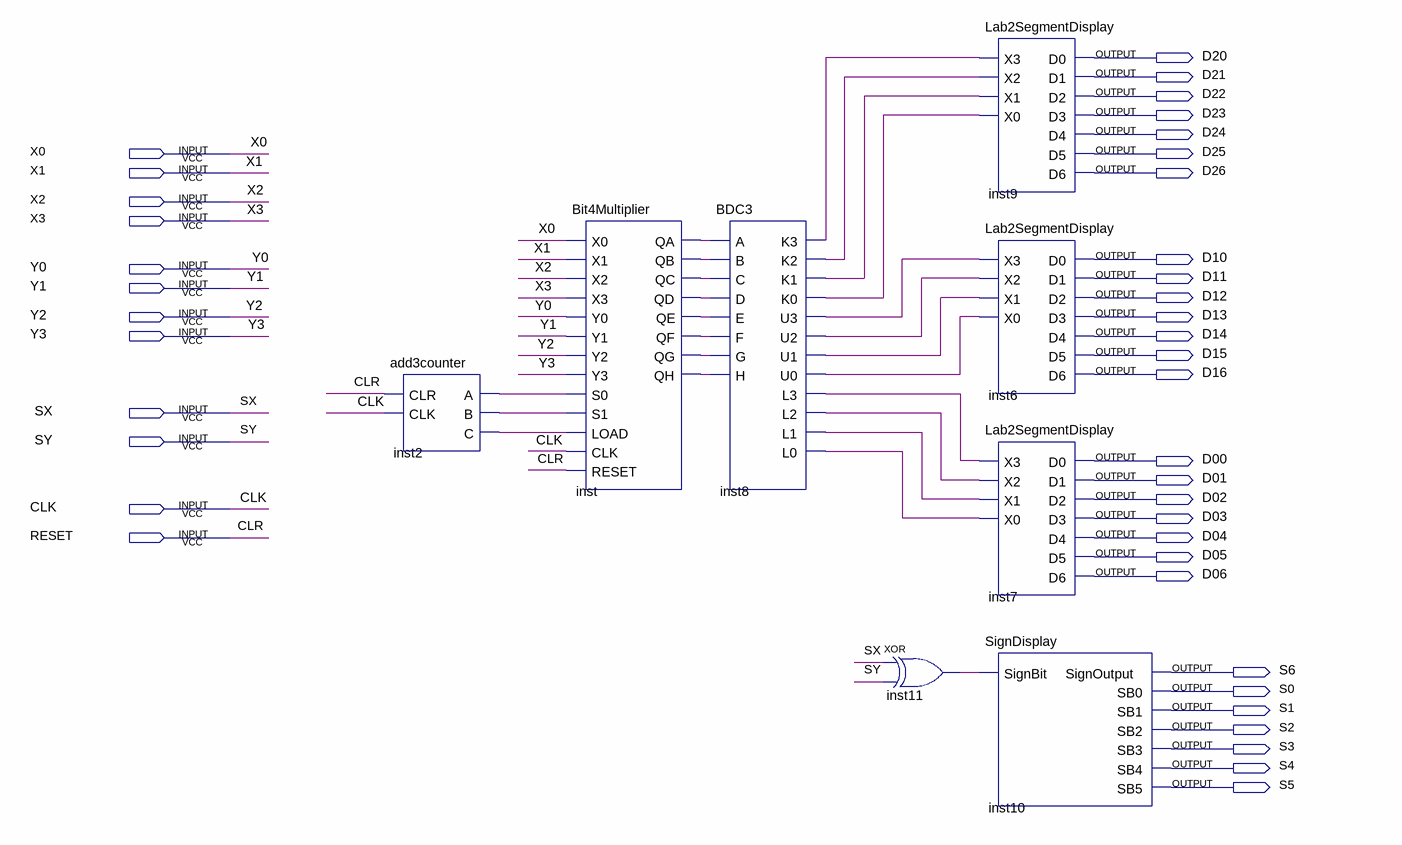
[diagram p0: schematic sheet]
// Quartus schematic Bit4MultDisplay.bdf as structural Verilog: 8 symbols, 40 pins
module Bit4MultDisplay (
  input  X0,
  input  X1,
  input  X2,
  input  X3,
  input  Y0,
  input  Y1,
  input  Y2,
  input  Y3,
  input  SX,
  input  SY,
  input  CLK,
  input  RESET,
  output D20,
  output D21,
  output D22,
  output D23,
  output D24,
  output D25,
  output D26,
  output D10,
  output D11,
  output D12,
  output D13,
  output D14,
  output D15,
  output D16,
  output D00,
  output D01,
  output D02,
  output D03,
  output D04,
  output D05,
  output D06,
  output S6,
  output S0,
  output S1,
  output S2,
  output S3,
  output S4,
  output S5
);

  wire inst2_a, inst2_b, inst2_c, inst8_k0, inst8_k1, inst8_k2, inst8_k3, inst8_l0, inst8_l1, inst8_l2,
       inst8_l3, inst8_u0, inst8_u1, inst8_u2, inst8_u3, inst11_out, inst_qa, inst_qb, inst_qc, inst_qd,
       inst_qe, inst_qf, inst_qg, inst_qh;

  add3counter inst2 (.CLR(RESET), .CLK(CLK), .A(inst2_a), .B(inst2_b), .C(inst2_c));
  Bit4Multiplier inst (
    .X0(X0), .X1(X1), .X2(X2), .X3(X3), .Y0(Y0), .Y1(Y1), .Y2(Y2), .Y3(Y3), .S0(inst2_a), .S1(inst2_b),
    .LOAD(inst2_c), .CLK(CLK), .RESET(RESET), .QA(inst_qa), .QB(inst_qb), .QC(inst_qc), .QD(inst_qd),
    .QE(inst_qe), .QF(inst_qf), .QG(inst_qg), .QH(inst_qh));
  BDC3 inst8 (
    .A(inst_qa), .B(inst_qb), .C(inst_qc), .D(inst_qd), .E(inst_qe), .F(inst_qf), .G(inst_qg), .H(inst_qh),
    .K3(inst8_k3), .K2(inst8_k2), .K1(inst8_k1), .K0(inst8_k0), .U3(inst8_u3), .U2(inst8_u2), .U1(inst8_u1),
    .U0(inst8_u0), .L3(inst8_l3), .L2(inst8_l2), .L1(inst8_l1), .L0(inst8_l0));
  xor inst11 (inst11_out, SX, SY);
  Lab2SegmentDisplay inst9 (
    .X3(inst8_k3), .X2(inst8_k2), .X1(inst8_k1), .X0(inst8_k0), .D0(D20), .D1(D21), .D2(D22), .D3(D23),
    .D4(D24), .D5(D25), .D6(D26));
  Lab2SegmentDisplay inst6 (
    .X3(inst8_u3), .X2(inst8_u2), .X1(inst8_u1), .X0(inst8_u0), .D0(D10), .D1(D11), .D2(D12), .D3(D13),
    .D4(D14), .D5(D15), .D6(D16));
  Lab2SegmentDisplay inst7 (
    .X3(inst8_l3), .X2(inst8_l2), .X1(inst8_l1), .X0(inst8_l0), .D0(D00), .D1(D01), .D2(D02), .D3(D03),
    .D4(D04), .D5(D05), .D6(D06));
  SignDisplay inst10 (
    .SignBit(inst11_out), .SignOutput(S6), .SB0(S0), .SB1(S1), .SB2(S2), .SB3(S3), .SB4(S4), .SB5(S5));

  // Other names for the same wires on the sheet: CLR = RESET
endmodule
